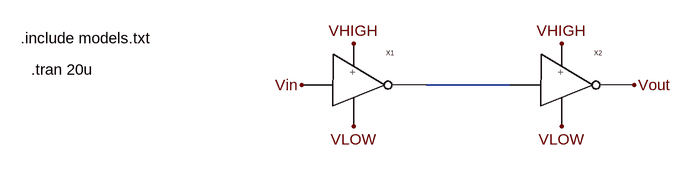
[diagram p0: schematic buffer.asc]
buffer.asc, the LTspice schematic file:
Version 4
SHEET 1 880 680
WIRE 352 160 224 160
FLAG 32 160 Vin
FLAG 544 160 Vout
FLAG 112 96 VHIGH
FLAG 432 96 VHIGH
FLAG 112 224 VLOW
FLAG 432 224 VLOW
SYMBOL inverter 112 160 R0
SYMATTR InstName X1
SYMBOL inverter 432 160 R0
SYMATTR InstName X2
TEXT -400 88 Left 2 !.include models.txt
TEXT -384 136 Left 2 !.tran 20u

The netlist it stands for:
* buffer.asc
XX1 Vin VHIGH VLOW N001 inverter  ; pins Vin VHIGH VLOW Vout
XX2 N001 VHIGH VLOW Vout inverter  ; pins Vin VHIGH VLOW Vout
.include models.txt
.tran 20u
.backanno
.end